# Altium schematic sheet H_Bridge.SchDoc
size A4; SheetNumber: 1
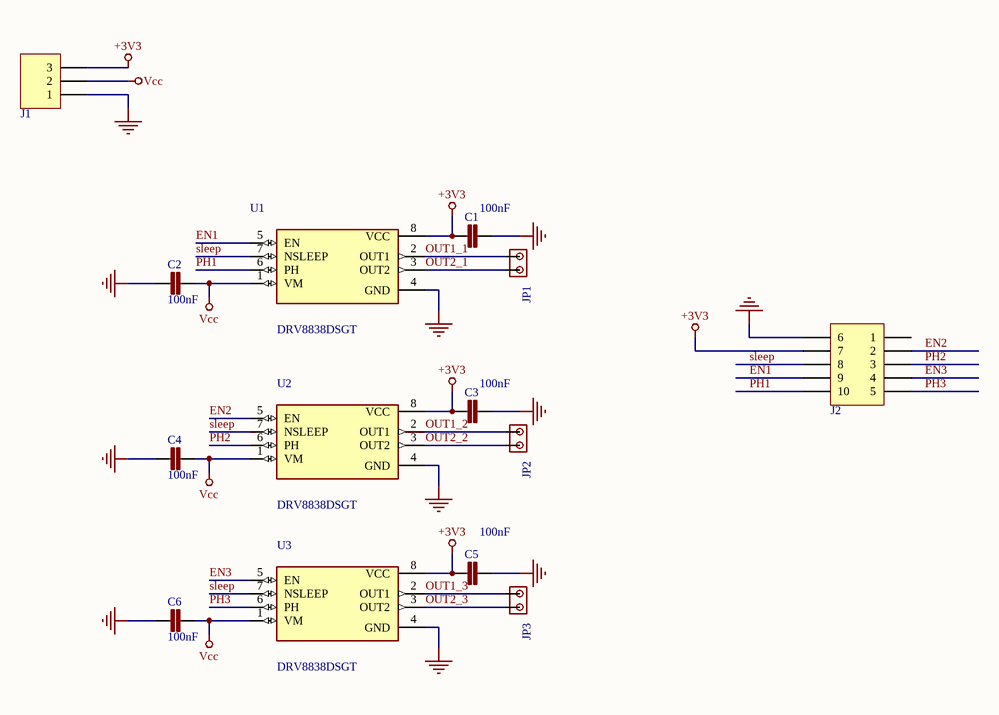
[diagram p0: H_Bridge.SchDoc]

## Parts
C1  value 100nF  [C0603]  (hidden comment: C-EUC0603)
C2  value 100nF  [C0603]  (hidden comment: C-EUC0603)
C3  value 100nF  [C0603]  (hidden comment: C-EUC0603)
C4  value 100nF  [C0603]  (hidden comment: C-EUC0603)
C5  value 100nF  [C0603]  (hidden comment: C-EUC0603)
C6  value 100nF  [C0603]  (hidden comment: C-EUC0603)
J1  03p  [61300311121]  (value not drawn)
J2  10p  [61301021121]  (value not drawn)
JP1  CONECT_BAT  [CONECT_BAT_PCK]  (value not drawn)
JP2  CONECT_BAT  [CONECT_BAT_PCK]  (value not drawn)
JP3  CONECT_BAT  [CONECT_BAT_PCK]  (value not drawn)
U1  DRV8838DSGT  [SON50P200X200X80-9N]
U2  DRV8838DSGT  [SON50P200X200X80-9N]
U3  DRV8838DSGT  [SON50P200X200X80-9N]

## Nets
+3V3: C1.1 C3.1 C5.1 J1.3 J2.7 U1.8(VCC) U2.8(VCC) U3.8(VCC)
GND: C1.2 C2.2 C3.2 C4.2 C5.2 C6.2 J1.1 J2.6 U1.4(GND) U2.4(GND) U3.4(GND)
Vcc: C2.1 C4.1 C6.1 J1.2 U1.1(VM) U2.1(VM) U3.1(VM)
EN1: J2.9 U1.5(EN)
EN2: J2.2 U2.5(EN)
EN3: J2.4 U3.5(EN)
OUT1_1: JP1.1 U1.2(OUT1)
OUT1_2: JP2.1 U2.2(OUT1)
OUT1_3: JP3.1 U3.2(OUT1)
OUT2_1: JP1.2 U1.3(OUT2)
OUT2_2: JP2.2 U2.3(OUT2)
OUT2_3: JP3.2 U3.3(OUT2)
PH1: J2.10 U1.6(PH)
PH2: J2.3 U2.6(PH)
PH3: J2.5 U3.6(PH)
sleep: J2.8 U1.7(NSLEEP) U2.7(NSLEEP) U3.7(NSLEEP)

Not connected (* = marked no-connect by the designer): J2 1

## Notes on the sheet
- Projeto:
- Data:
- Subtítulo:
- Folha:
- Revisão:

## Library data of the parts
C1-C6 = C-EUC0603: Part Number: 06033C104KAT2A; Vendor: AVX; Família: Capacitor
J1 = 61300311121: WR-PHD 2.54 mm THT Pin Header, 03p; Vendor: Wurth Elektronik; Part Number: 61300311121; Value: 03p
J2 = 61301021121: WR-PHD 2.54 mm THT Dual Pin Header, 10p; Vendor: Wurth Elektronik; Part Number: 61301021121; Value: 10p
U1-U3 = DRV8838DSGT: 1.8A Low Voltage Brushed DC Motor Driver 8-WSON -40 to 85; MF: Texas Instruments; Package: WSON-8 Texas Instruments; SnapEDA_Link: https://www.snapeda.com/parts/DRV8838DSGT/Texas%20Instruments/view-part/?ref=snap; Availability: Good; Price: 0.98 USD; MP: DRV8838DSGT; Value: *